# Altium schematic sheet Power.SchDoc
size 420 x 297 mm; SheetNumber: 3; SheetTotal: 5; SPICEModelCacheCTWGKBXG: <root> / <DocumentId>CTWGKBXG</DocumentId> / <CacheFrame Number="0"> / <Model Name="nmos" Kind="MDL"> / <Text>*Default N-Channel MOSFET / *Pinout: D,G,S / .MODEL NMOS NMOS()</Text> / </Model> / </CacheFrame> / </root>
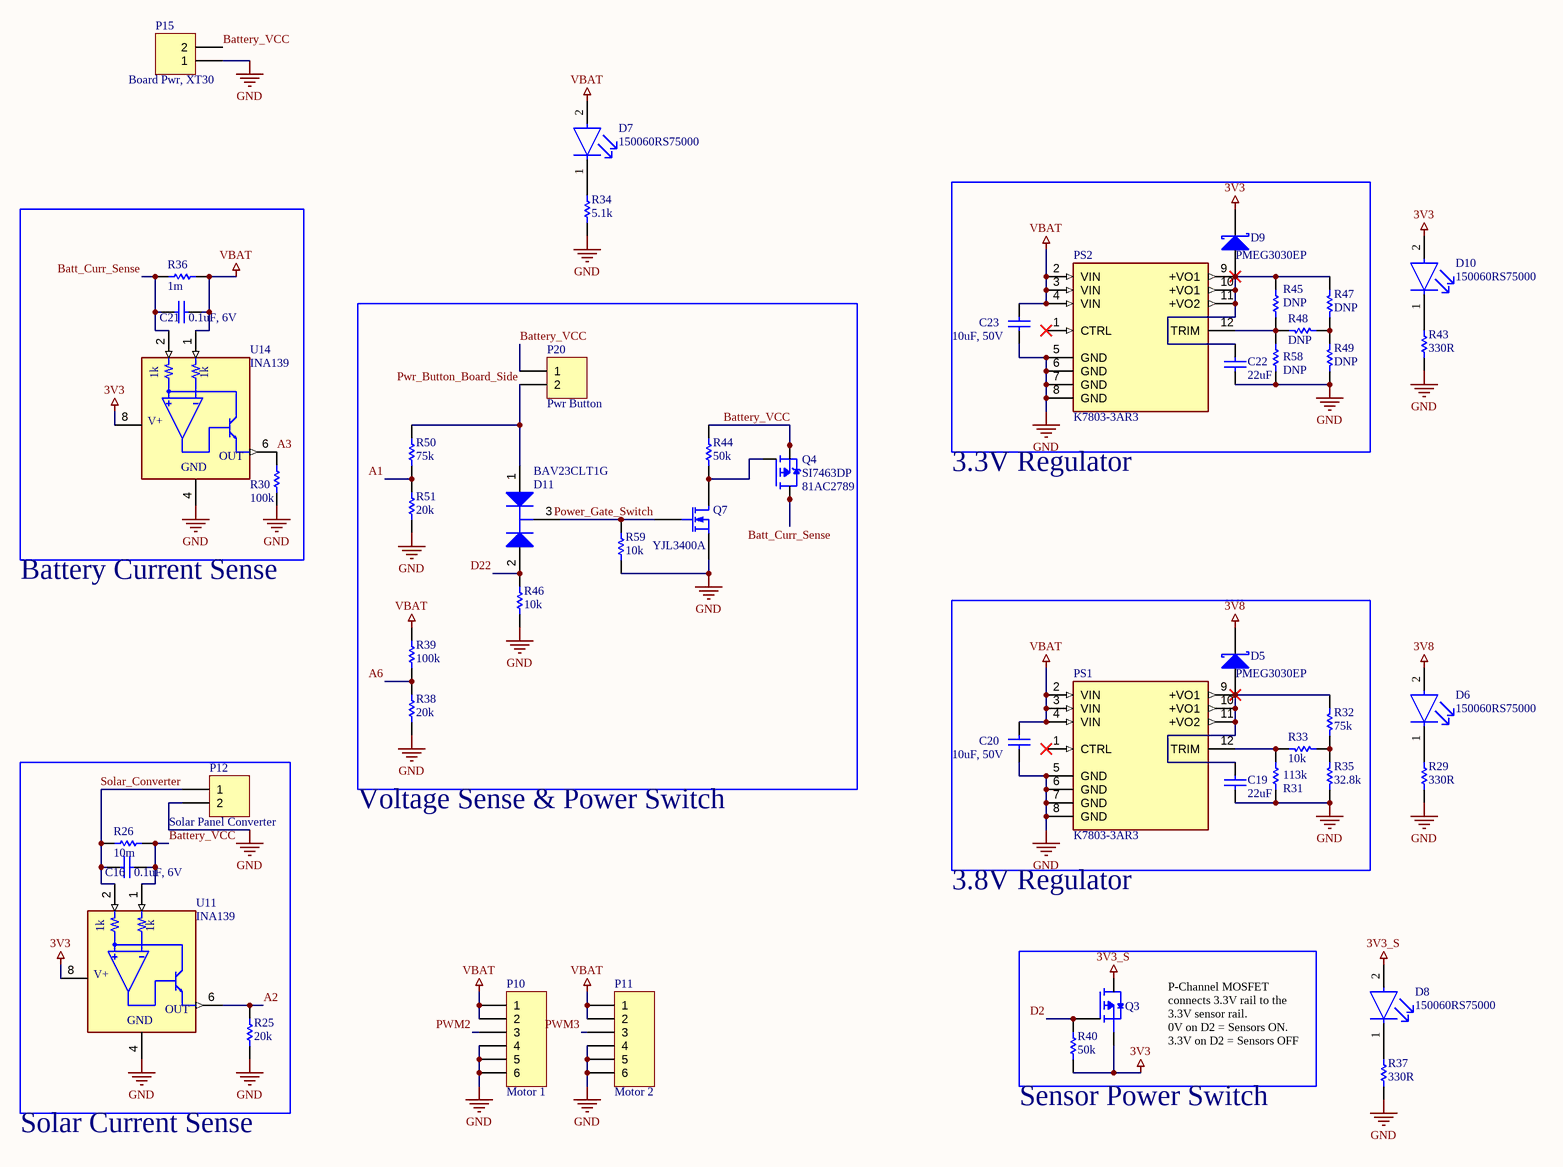
[diagram p0: Power.SchDoc]

## Parts
C16  value 0.1uF, 6V  [ANTC1608X90N]  (hidden comment: Capacitor)
C19  value 22uF  [ANTC1608X90N]  (hidden comment: Capacitor)
C20  value 10uF, 50V  [CAPC2012X145N]  (hidden comment: Capacitor)
C21  value 0.1uF, 6V  [ANTC1608X90N]  (hidden comment: Capacitor)
C22  value 22uF  [ANTC1608X90N]  (hidden comment: Capacitor)
C23  value 10uF, 50V  [CAPC2012X145N]  (hidden comment: Capacitor)
D5  PMEG3030EP  [SODFL470X110-2N]
D6  150060RS75000  [FP-150060RS75000-MFG]
D7  150060RS75000  [FP-150060RS75000-MFG]
D8  150060RS75000  [FP-150060RS75000-MFG]
D9  PMEG3030EP  [SODFL470X110-2N]
D10  150060RS75000  [FP-150060RS75000-MFG]
D11  BAV23CLT1G  [ONSC-SOT-23-3-318-08_V]
P10  Motor 1  [TE_1586039-6]
P11  Motor 2  [TE_1586039-6]
P12  Solar Panel Converter  [XT30_Horizontal]
P15  Board Pwr, XT30  [XT30_Horizontal]
P20  Pwr Button  [TE_6-440054-2]
PS1  K7803-3AR3  [CONV_K7803-3AR3]
PS2  K7803-3AR3  [CONV_K7803-3AR3]
Q3  YJL3415A  [SOT23-3]  (value not drawn)
Q4  SI7463DP  Supplier Part Number 1: 81AC2789  [SIR165DP]
Q7  YJL3400A  [SOT23-3]
R25  value 20k  [0603 Resistor]  (hidden comment: Resistor)
R26  value 10m  [RESC6331X70N]  (hidden comment: Resistor)
R29  value 330R  [0603 Resistor]  (hidden comment: Resistor)
R30  value 100k  [0603 Resistor]  (hidden comment: Resistor)
R31  value 113k  [0603 Resistor]  (hidden comment: Resistor)
R32  value 75k  [0603 Resistor]  (hidden comment: Resistor)
R33  value 10k  [0603 Resistor]  (hidden comment: Resistor)
R34  value 5.1k  [0603 Resistor]  (hidden comment: Resistor)
R35  value 32.8k  [0603 Resistor]  (hidden comment: Resistor)
R36  value 1m  [RESC6331X70N]  (hidden comment: Resistor)
R37  value 330R  [0603 Resistor]  (hidden comment: Resistor)
R38  value 20k  [0603 Resistor]  (hidden comment: Resistor)
R39  value 100k  [0603 Resistor]  (hidden comment: Resistor)
R40  value 50k  [0603 Resistor]  (hidden comment: Resistor)
R43  value 330R  [0603 Resistor]  (hidden comment: Resistor)
R44  value 50k  [0603 Resistor]  (hidden comment: Resistor)
R45  value DNP  [0603 Resistor]  (hidden comment: Resistor)
R46  value 10k  [0603 Resistor]  (hidden comment: Resistor)
R47  value DNP  [0603 Resistor]  (hidden comment: Resistor)
R48  value DNP  [0603 Resistor]  (hidden comment: Resistor)
R49  value DNP  [0603 Resistor]  (hidden comment: Resistor)
R50  value 75k  [0603 Resistor]  (hidden comment: Resistor)
R51  value 20k  [0603 Resistor]  (hidden comment: Resistor)
R58  value DNP  [0603 Resistor]  (hidden comment: Resistor)
R59  value 10k  [0603 Resistor]  (hidden comment: Resistor)
U11  INA139  [INA139-Q1]
U14  INA139  [INA139-Q1]

## Nets
3V3: D9.2(K) D10.2(A) Q3.3(D) R40.1 U11.8(V+) U14.8(V+)
3V3_S: D8.2(A) Q3.2(S)
3V8: D5.2(K) D6.2(A)
GND: C19.1 C20.1 C22.1 C23.1 P10.4 P10.5 P10.6 P11.4 P11.5 P11.6 P12.2 P15.1 PS1.5(GND) PS1.6(GND) PS1.7(GND) PS1.8(GND) PS2.5(GND) PS2.6(GND) PS2.7(GND) PS2.8(GND) Q7.2(S) R25.1 R29.2 R30.1 R31.1 R34.2 R35.1 R37.2 R38.1 R43.2 R46.1 R49.1 R51.1 R58.1 R59.1 U11.4(GND) U14.4(GND)
VBAT: C20.2 C21.1 C23.2 D7.2(A) P10.1 P10.2 P11.1 P11.2 PS1.2(VIN) PS1.3(VIN) PS1.4(VIN) PS2.2(VIN) PS2.3(VIN) PS2.4(VIN) R36.1 R39.2 U14.1(VIN-)
A1: R50.1 R51.2
A2: R25.2 U11.6(OUT)
A3: R30.2 U14.6(OUT)
A6: R38.2 R39.1
Batt_Curr_Sense: C21.2 Q4.5(D) Q4.6(D) Q4.7(D) Q4.8(D) Q4.9(D) R36.2 U14.2(VIN+)
Battery_VCC: C16.1 P15.2 P20.1 Q4.1(S) Q4.2(S) Q4.3(S) R26.2 R44.2 U11.1(VIN-)
D2: Q3.1(G) R40.2
D22: D11.2(A2) R46.2
Power_Gate_Switch: D11.3(K) Q7.1(G) R59.2
PWM2: P10.3
PWM3: P11.3
Pwr_Button_Board_Side: D11.1(A1) P20.2 R50.2
Solar_Converter: C16.2 P12.1 R26.1 U11.2(VIN+)
NetC19_2: C19.2 D5.1(A) PS1.9(+VO1) PS1.10(+VO1) PS1.11(+VO2) R32.2
NetC22_2: C22.2 D9.1(A) PS2.9(+VO1) PS2.10(+VO1) PS2.11(+VO2) R45.2 R47.2
NetD6_1: D6.1(C) R29.1
NetD7_1: D7.1(C) R34.1
NetD8_1: D8.1(C) R37.1
NetD10_1: D10.1(C) R43.1
NetPS1_12: PS1.12(TRIM) R31.2 R33.1
NetPS2_12: PS2.12(TRIM) R45.1 R48.1 R58.2
NetQ4_4: Q4.4(G) Q7.3(D) R44.1
NetR32_1: R32.1 R33.2 R35.2
NetR47_1: R47.1 R48.2 R49.2

Not connected (* = marked no-connect by the designer): PS1 1(CTRL)*; PS2 1(CTRL)*

## Notes on the sheet
- (near PS2) 3.3V Regulator
- Battery Current Sense
- Voltage Sense & Power Switch
- (near PS1) 3.8V Regulator
- P-Channel MOSFET connects 3.3V rail to the 3.3V sensor rail.               0V on D2 = Sensors ON.                             3.3V on D2 = Sensors OFF
- (near R40) Sensor Power Switch
- Solar Current Sense
- THIS DOCUMENT AND THE DATA DISCLOSED HEREIN OR
- HEREWITH IS THE PROPERTY OF ALTIUM LIMITED AND MAY
- DWG NO:
- REVISION
- REV:
- DESCRIPTION
- DATE
- APPROVED
- BE FREELY DISTRIBUTED IN WHOLE. NO RIGHTS ARE
- RESERVED OR EXPRESS OR IMPLIED WARANTEE GIVEN.
- ENG:
- APPROVALS
- PROJECT
- DSN:
- CHK:
- REFERENCE DOCUMENTS
- PROJECT REVISION:
- TITLE
- DOCUMENT REVISION:
- DESIGN ITEM:
- BOM:
- FAB DWG:
- PCB DWG:
- ASSY DWG:
- SCALE:
- A3
- SIZE
- CAGE CODE
- FILE NAME
- DWG NO.
- SHEET
- OF
- REV
- (in symbol INA139) 1k

## Library data of the parts
C16 C19-C23 = Capacitor: SimulationGenericComponent: True
D5 D9 = Shottky Diode: AF: 1; BV: 0; BV_MAX: 1e99; EG: 1.11; FC: 0.5; IBV: 0.001; IS: 1e-14; MJSW: 0.33; NTUN: 30; TNOM: 27; XTI: 3; SimulationGenericComponent: True; CJO: 0; CJP: 0; CTA: 0; CTP: 0; FCS: 0.5; FV_MAX: 1e99; IKF: 0; IKR: 0; ISR: 1e-14; JSW: 0; JTUN: 0; JTUNSW: 0; KEG: 1; KF: 0; LEVEL: 1; N: 1; NBV: 1; NR: 1; NS: 1; PHP: 1; RS: 0; TCV: 0; TLEV: 0; TLEVC: 0; TM1: 0; TM2: 0; TPB: 0; TPHP: 0; TRS: 0; TRS2: 0; TT: 0; TTT1: 0; TTT2: 0; VJ: 1; XTITUN: 3
D6-D8 D10 = CMP-1426-00001-2: LED RED CLEAR 0603 SMD; Luminous Intensity: 250mcd; Viewing Angle: 140°; Dominant Wavelength: 625nm; Test Current: 20mA; Forward Current: 30mA; Forward Voltage: 2V; Lens Color: Colorless; Lens Size: 0.7mm; Width: 0.8mm; Series: WL-SMCW; Color: Red; Min Operating Temperature: -40°C; RoHS Compliant: Yes; Height: 0.8mm; Package Quantity: 1; Packaging: Cut Tape; Mount: Surface Mount; Case/Package: 0603; Lens Transparency: Clear; Length: 1.6mm; Case Code (Imperial): 0603; Lens Style: Clear; Wavelength: 625nm; Max Operating Temperature: 85°C; Case Code (Metric): 1608
D11 = CMP-1054-00102-1: Dual High Voltage Common Cathode Switching Diodes, 3-Pin SOT-23, Pb-Free, Tape and Reel; Manufacturer: On Semiconductor; IF Max (A): 0.4; trr Max (ns): 150; ComponentLink1Description: Manufacturer URL; ComponentLink2URL: http://www.onsemi.com/pub_link/Collateral/BAV23CLT1-D.PDF; Packing: Tape and Reel; PackageReference: SOT-23-3-318-08; Configuration: Common Cathode; Mounting Technology: Surface Mount; DatasheetVersion: Rev. 2; ComponentLink3Description: Package Specification; PartNumber: BAV23CLT1G; ComponentLink1URL: http://www.onsemi.com/; PackageDescription: 3-Pin Small Outline Transistor, Body 2.92 x 1.3 mm, Pitch 0.95 mm; RoHS: TRUE; ComponentLink3URL: http://www.onsemi.cn/pub_link/Collateral/318-08.PDF; PackageVersion: Rev. AP, 11/2009; ComponentLink2Description: Datasheet
P10 P11 = Header 6: Header, 6-Pin; LatestRevisionDate: 17-Jul-2002; LatestRevisionNote: Re-released for DXP Platform.; Publisher: Altium Limited
P12 P15 P20 = Header 2: Header, 2-Pin; LatestRevisionDate: 17-Jul-2002; LatestRevisionNote: Re-released for DXP Platform.; Publisher: Altium Limited
PS1 PS2 = K7803-3AR3: Non-Isolated PoL Module DC DC Converter 1 Output 3.3V - - - 3A 8V - 36V Input; MF: Mornsun America, LLC; MP: K7803-3AR3; Purchase-URL: https://pricing.snapeda.com/search/part/K7803-3AR3/?ref=eda; SnapEDA_Link: https://www.snapeda.com/parts/K7803-3AR3/MORNSUN/view-part/?ref=snap; Check_prices: https://www.snapeda.com/parts/K7803-3AR3/MORNSUN/view-part/?ref=eda; Digi-Key_Part_Number: 2725-K7803-3AR3-ND; Package: SIP-12-12 MORNSUN; Value: *
Q3 = YJL3415A: P-Channel MOSFET
Q4 = SI7463DP: MOSFET P-CH 30V 60A PPAK SO-8; MF: Vishay; Check_prices: https://www.snapeda.com/parts/SI7463DP/Vishay/view-part/2773444/?ref=eda; Value: *; Purchase-URL: https://pricing.snapeda.com/search/part/SI7463DP/?ref=eda; Package: SO-8 Vishay; Price: None; MP: SI7463DP; Availability: In Stock; SnapEDA_Link: https://www.snapeda.com/parts/SI7463DP/Vishay/view-part/2773444/?ref=snap; Supplier 1: Newark
Q7 = MOSFET-N: N-Channel MOSFET; Published: 8-Jun-2000; LatestRevisionDate: 17-Jul-2002; LatestRevisionNote: Re-released for DXP Platform.; PackageVersion: 1995/1996; PackageReference: E3; Publisher: Altium Limited; PackageDescription: TO, Flat Index; 3 In-Line, Axial Leads; Body Dia. 4.6mm; Lead Dia. 0.5 mm (max)
R25 R26 R29-R40 R43-R51 R58 R59 = Resistor: TC1: 0; SimulationGenericComponent: True; TC2: 0
U11 U14 = INA139: Current Monitor Regulator High-Side SOT-23-5; MF: Texas Instruments; Package: SOT-23-5 Texas Instruments; Value: *; Availability: Unavailable; MP: INA139; SnapEDA_Link: https://www.snapeda.com/parts/INA139/Texas%20Instruments/view-part/560986/?ref=snap; Price: None